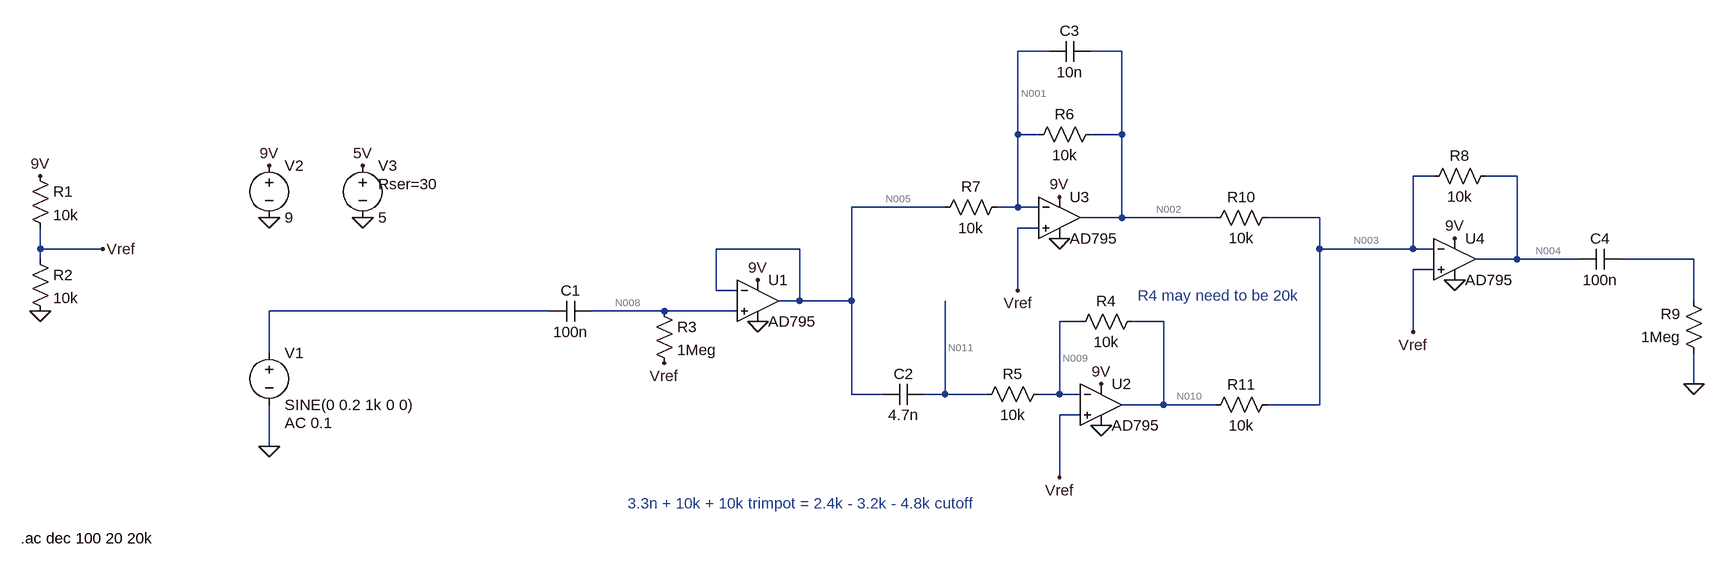
[diagram p0: schematic Draft2.asc]
Draft2.asc, the LTspice schematic file:
Version 4
SHEET 1 2196 680
WIRE 1184 -320 1136 -320
WIRE 1296 -320 1248 -320
WIRE 1136 -192 1136 -320
WIRE 1168 -192 1136 -192
WIRE 1296 -192 1296 -320
WIRE 1296 -192 1248 -192
WIRE 1776 -128 1744 -128
WIRE 1904 -128 1856 -128
WIRE 1024 -80 880 -80
WIRE 1136 -80 1136 -192
WIRE 1136 -80 1104 -80
WIRE 1168 -80 1136 -80
WIRE 1296 -64 1296 -192
WIRE 1296 -64 1232 -64
WIRE 1440 -64 1296 -64
WIRE 1600 -64 1520 -64
WIRE 1168 -48 1136 -48
WIRE -368 -16 -368 -48
WIRE -272 -16 -368 -16
WIRE 800 -16 672 -16
WIRE 1600 -16 1600 -64
WIRE 1744 -16 1744 -128
WIRE 1744 -16 1600 -16
WIRE 1776 -16 1744 -16
WIRE -368 0 -368 -16
WIRE 1904 0 1904 -128
WIRE 1904 0 1840 0
WIRE 2000 0 1904 0
WIRE 2176 0 2064 0
WIRE 1776 16 1744 16
WIRE 672 48 672 -16
WIRE 704 48 672 48
WIRE 1136 48 1136 -48
WIRE 800 64 800 -16
WIRE 800 64 768 64
WIRE 880 64 880 -80
WIRE 880 64 800 64
WIRE 2176 64 2176 0
WIRE 416 80 -16 80
WIRE 592 80 480 80
WIRE 704 80 592 80
WIRE 1232 96 1200 96
WIRE 1360 96 1312 96
WIRE 1744 112 1744 16
WIRE -16 144 -16 80
WIRE 2176 192 2176 144
WIRE 880 208 880 64
WIRE 928 208 880 208
WIRE 1024 208 1024 64
WIRE 1024 208 992 208
WIRE 1088 208 1024 208
WIRE 1200 208 1200 96
WIRE 1200 208 1168 208
WIRE 1232 208 1200 208
WIRE 1360 224 1360 96
WIRE 1360 224 1296 224
WIRE 1440 224 1360 224
WIRE 1600 224 1600 -16
WIRE 1600 224 1520 224
WIRE 1232 240 1200 240
WIRE -16 288 -16 224
WIRE 1200 336 1200 240
FLAG -16 -64 0
FLAG -16 -144 9V
FLAG 128 -64 0
FLAG 128 -144 5V
FLAG -16 288 0
FLAG 736 96 0
FLAG 736 32 9V
FLAG -368 80 0
FLAG -368 -128 9V
FLAG -272 -16 Vref
FLAG 592 160 Vref
FLAG 1264 256 0
FLAG 1264 192 9V
FLAG 1200 336 Vref
FLAG 1200 -32 0
FLAG 1200 -96 9V
FLAG 1136 48 Vref
FLAG 1808 32 0
FLAG 1808 -32 9V
FLAG 1744 112 Vref
FLAG 2176 192 0
SYMBOL voltage -16 128 R0
WINDOW 123 24 124 Left 2
WINDOW 39 0 0 Left 2
SYMATTR InstName V1
SYMATTR Value SINE(0 0.2 1k 0 0)
SYMATTR Value2 AC 0.1
SYMBOL voltage -16 -160 R0
WINDOW 123 0 0 Left 2
WINDOW 39 0 0 Left 2
SYMATTR InstName V2
SYMATTR Value 9
SYMBOL voltage 128 -160 R0
WINDOW 123 0 0 Left 2
WINDOW 39 24 44 Left 2
SYMATTR InstName V3
SYMATTR Value 5
SYMATTR SpiceLine Rser=30
SYMBOL Opamps\\AD795 736 0 R0
SYMATTR InstName U1
SYMBOL res -384 -144 R0
SYMATTR InstName R1
SYMATTR Value 10k
SYMBOL res -384 -16 R0
SYMATTR InstName R2
SYMATTR Value 10k
SYMBOL res 576 64 R0
SYMATTR InstName R3
SYMATTR Value 1Meg
SYMBOL cap 480 64 R90
WINDOW 0 0 32 VBottom 2
WINDOW 3 32 32 VTop 2
SYMATTR InstName C1
SYMATTR Value 100n
SYMBOL Opamps\\AD795 1264 160 R0
SYMATTR InstName U2
SYMBOL res 1328 80 R90
WINDOW 0 0 56 VBottom 2
WINDOW 3 32 56 VTop 2
SYMATTR InstName R4
SYMATTR Value 10k
SYMBOL res 1184 192 R90
WINDOW 0 0 56 VBottom 2
WINDOW 3 32 56 VTop 2
SYMATTR InstName R5
SYMATTR Value 10k
SYMBOL cap 992 192 R90
WINDOW 0 0 32 VBottom 2
WINDOW 3 32 32 VTop 2
SYMATTR InstName C2
SYMATTR Value 4.7n
SYMBOL Opamps\\AD795 1200 -128 R0
SYMATTR InstName U3
SYMBOL res 1264 -208 R90
WINDOW 0 0 56 VBottom 2
WINDOW 3 32 56 VTop 2
SYMATTR InstName R6
SYMATTR Value 10k
SYMBOL res 1120 -96 R90
WINDOW 0 0 56 VBottom 2
WINDOW 3 32 56 VTop 2
SYMATTR InstName R7
SYMATTR Value 10k
SYMBOL cap 1248 -336 R90
WINDOW 0 0 32 VBottom 2
WINDOW 3 32 32 VTop 2
SYMATTR InstName C3
SYMATTR Value 10n
SYMBOL Opamps\\AD795 1808 -64 R0
SYMATTR InstName U4
SYMBOL res 1872 -144 R90
WINDOW 0 0 56 VBottom 2
WINDOW 3 32 56 VTop 2
SYMATTR InstName R8
SYMATTR Value 10k
SYMBOL res 1536 -80 R90
WINDOW 0 0 56 VBottom 2
WINDOW 3 32 56 VTop 2
SYMATTR InstName R10
SYMATTR Value 10k
SYMBOL res 1536 208 R90
WINDOW 0 0 56 VBottom 2
WINDOW 3 32 56 VTop 2
SYMATTR InstName R11
SYMATTR Value 10k
SYMBOL cap 2064 -16 R90
WINDOW 0 0 32 VBottom 2
WINDOW 3 32 32 VTop 2
SYMATTR InstName C4
SYMATTR Value 100n
SYMBOL res 2192 160 R180
WINDOW 0 36 76 Left 2
WINDOW 3 36 40 Left 2
SYMATTR InstName R9
SYMATTR Value 1Meg
TEXT 536 376 Left 2 ;3.3n + 10k + 10k trimpot = 2.4k - 3.2k - 4.8k cutoff
TEXT 1320 56 Left 2 ;R4 may need to be 20k
TEXT -398 430 Left 2 !.ac dec 100 20 20k

The netlist it stands for:
* Draft2.asc
V1 N007 0 SINE(0 0.2 1k 0 0) AC 0.1
V2 9V 0 9
V3 5V 0 5 Rser=30
XU1 N008 N005 9V 0 N005 AD795  ; pins In+ In- V+ V- OUT
R1 9V Vref 10k
R2 Vref 0 10k
R3 N008 Vref 1Meg
C1 N008 N007 100n
XU2 Vref N009 9V 0 N010 AD795  ; pins In+ In- V+ V- OUT
R4 N010 N009 10k
R5 N009 N011 10k
C2 N011 N005 4.7n
XU3 Vref N001 9V 0 N002 AD795  ; pins In+ In- V+ V- OUT
R6 N002 N001 10k
R7 N001 N005 10k
C3 N002 N001 10n
XU4 Vref N003 9V 0 N004 AD795  ; pins In+ In- V+ V- OUT
R8 N004 N003 10k
R10 N003 N002 10k
R11 N003 N010 10k
C4 N006 N004 100n
R9 0 N006 1Meg
* 3.3n + 10k + 10k trimpot = 2.4k - 3.2k - 4.8k cutoff
* R4 may need to be 20k
.ac dec 100 20 20k
.lib ADI1.lib
.backanno
.end

* Results of the author's LTspice run, read from the files saved beside the schematic
* Operating Point, zero values left out:
*   V(9v) = 9 V
*   V(5v) = 5 V
*   V(n008) = 4.5 V
*   V(n005) = 4.5 V
*   V(vref) = 4.5 V
*   V(n009) = 4.5 V
*   V(n010) = 4.5 V
*   V(n011) = 4.5 V
*   V(n001) = 4.5 V
*   V(n002) = 4.5 V
*   V(n003) = 4.5 V
*   V(n004) = 4.5 V
*   I(R11) = 3.464 pA
*   I(R10) = 343.4 pA
*   I(R8) = 343.4 pA
*   I(R7) = -340 pA
*   I(R6) = -343.4 pA
*   I(R4) = -3.465 pA
*   I(R3) = 3.4 pA
*   I(R2) = 450 µA
*   I(R1) = 450 µA
*   I(V2) = -5.619 mA
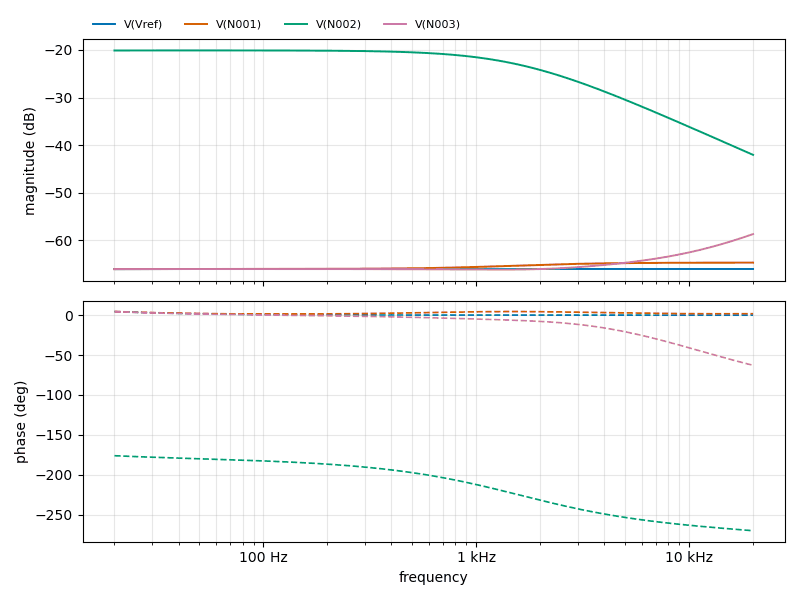
[diagram p1: AC Analysis of Draft2.asc, plotted from the saved traces]
* AC Analysis, 1 run:
*   V(Vref): -66.09 dB at 20 Hz, -66.06 dB at 20 kHz, peak -66.06 dB at 2.047 kHz
*   V(N001): -66.09 dB at 20 Hz, -64.72 dB at 20 kHz, peak -64.72 dB at 20 kHz
*   V(N002): -20.11 dB at 20 Hz, -42.06 dB at 20 kHz, peak -20.10 dB at 50.24 Hz, 3 dB below the peak at 1.593 kHz
*   V(N003): -66.09 dB at 20 Hz, -58.72 dB at 20 kHz, peak -58.72 dB at 20 kHz, 3 dB below the peak at 12.02 kHz